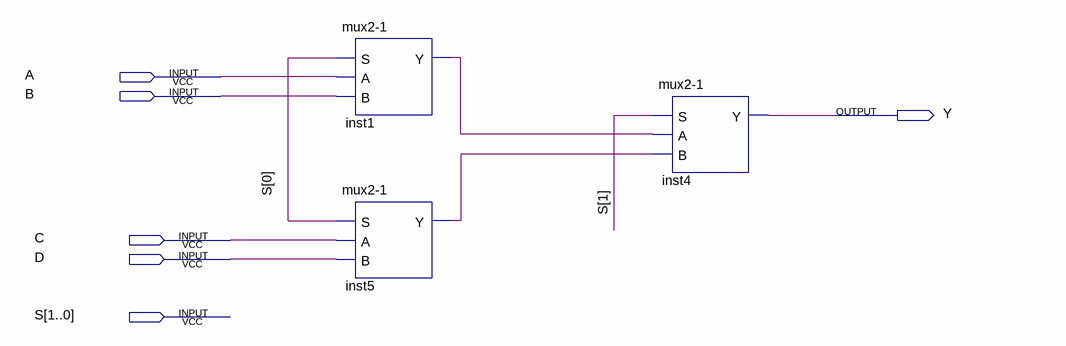
[diagram p0: schematic sheet]
// Quartus schematic mux4-1.bdf as structural Verilog: 3 symbols, 6 pins
module \mux4-1  (
  input  A,
  input  B,
  input  C,
  input  D,
  input  [1:0] S,
  output Y
);

  wire inst1_y, inst5_y;

  \mux2-1  inst1 (.S(S[0]), .A(A), .B(B), .Y(inst1_y));
  \mux2-1  inst5 (.S(S[0]), .A(C), .B(D), .Y(inst5_y));
  \mux2-1  inst4 (.S(S[1]), .A(inst1_y), .B(inst5_y), .Y(Y));
endmodule
